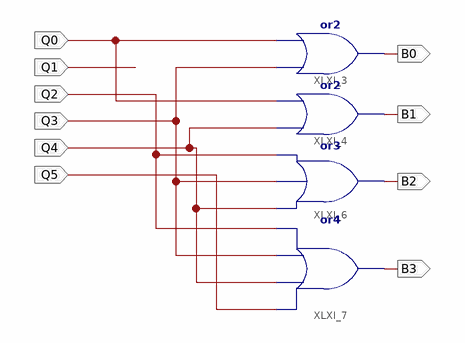
[diagram p0: schematic sheet 1]
// Xilinx ISE schematic dekoder.sch (spartan3e) as structural Verilog: 4 symbols, 10 ports
module dekoder (
  input  Q3,
  input  Q0,
  input  Q4,
  input  Q2,
  input  Q5,
  input  Q1,
  output B0,
  output B1,
  output B2,
  output B3
);

  or XLXI_3 (B0, Q3, Q0);
  or XLXI_4 (B1, Q4, Q0);
  or XLXI_6 (B2, Q4, Q3, Q2);
  or XLXI_7 (B3, Q5, Q4, Q3, Q2);
endmodule
